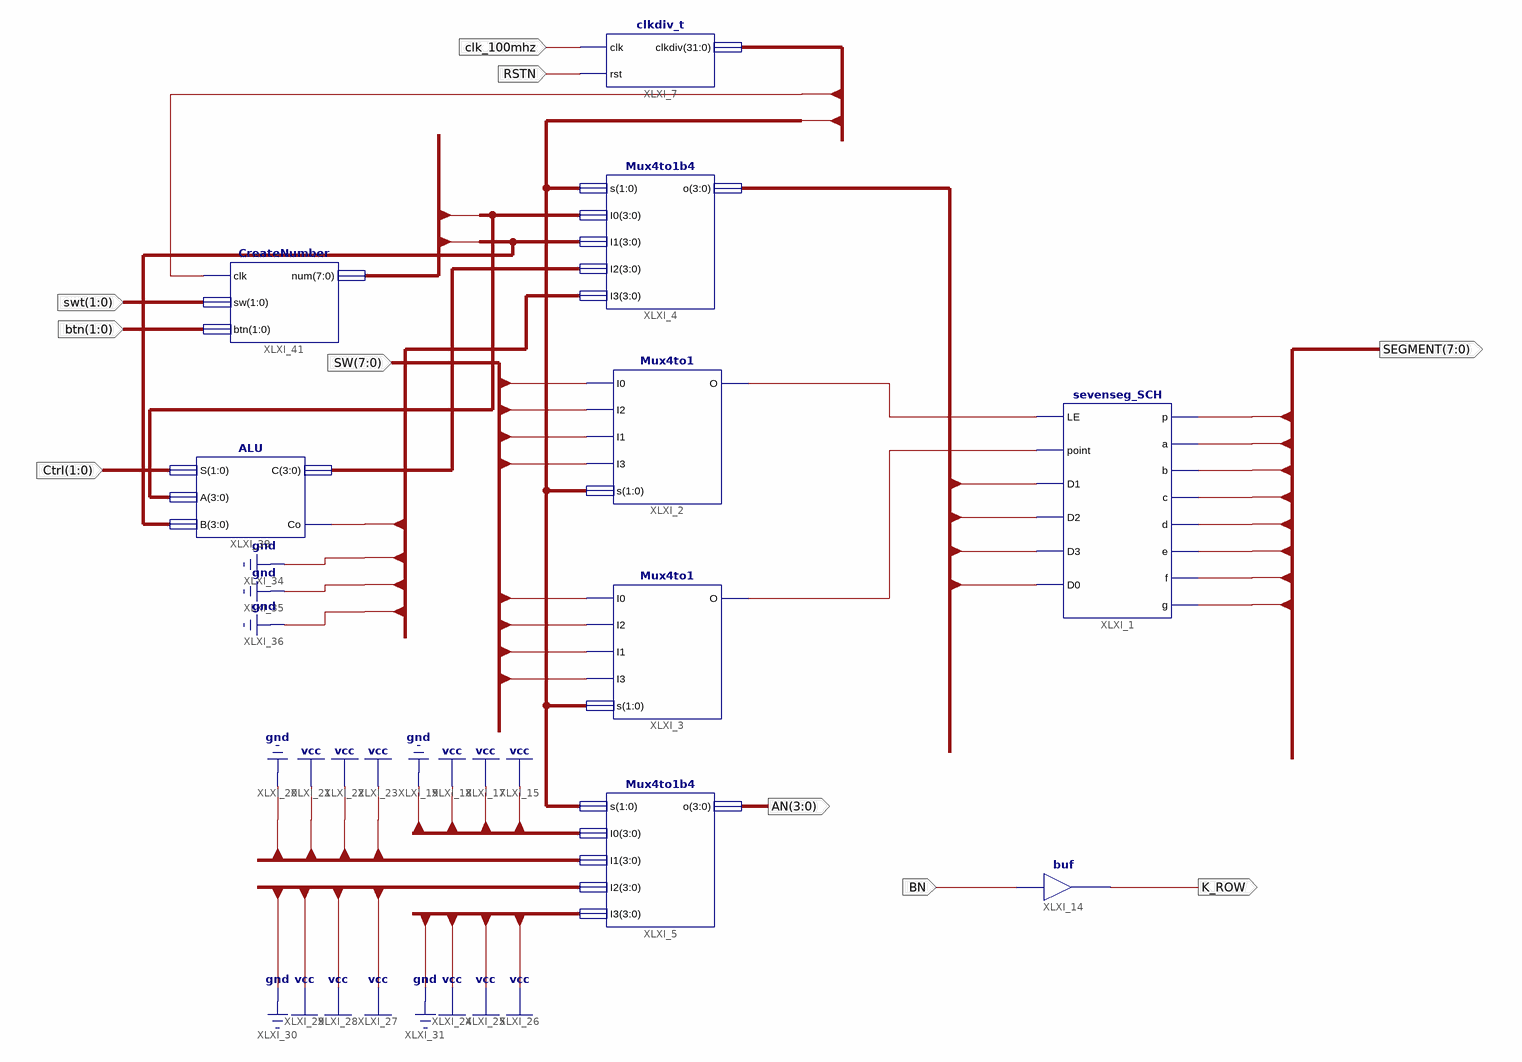
[diagram p0: schematic sheet 1]
// Xilinx ISE schematic scoreboard_sch.sch (kintex7) as structural Verilog: 9 symbols, 10 ports
module scoreboard_sch (
  input  [7:0] SW,
  input  BN,
  input  clk_100mhz,
  input  RSTN,
  input  [1:0] Ctrl,
  input  [1:0] swt,
  input  [1:0] btn,
  output [7:0] SEGMENT,
  output K_ROW,
  output [3:0] AN
);

  wire XLXN_23, XLXN_24;
  wire [0:0] I3;
  wire [3:0] o, XLXN_28;
  wire [7:0] num;
  wire [31:0] clkdiv;

  sevenseg_SCH XLXI_1 (
    .LE(XLXN_23), .point(XLXN_24), .D1(o[1]), .D2(o[2]), .D3(o[3]), .D0(o[0]), .p(SEGMENT[7]),
    .a(SEGMENT[0]), .b(SEGMENT[1]), .c(SEGMENT[2]), .d(SEGMENT[3]), .e(SEGMENT[4]), .f(SEGMENT[5]),
    .g(SEGMENT[6]));
  Mux4to1 XLXI_2 (.I0(SW[0]), .I2(SW[2]), .I1(SW[1]), .I3(SW[3]), .s(clkdiv[18:17]), .O(XLXN_23));
  Mux4to1 XLXI_3 (.I0(SW[4]), .I2(SW[6]), .I1(SW[5]), .I3(SW[7]), .s(clkdiv[18:17]), .O(XLXN_24));
  Mux4to1b4 XLXI_4 (.s(clkdiv[18:17]), .I0(num[3:0]), .I1(num[7:4]), .I2(XLXN_28), .I3({3'b000, I3[0]}), .o(o));
  Mux4to1b4 XLXI_5 (.s(clkdiv[18:17]), .I0(4'b1110), .I1(4'b1101), .I2(4'b1011), .I3(4'b0111), .o(AN));
  clkdiv_t XLXI_7 (.clk(clk_100mhz), .rst(RSTN), .clkdiv(clkdiv));
  buf XLXI_14 (K_ROW, BN);
  ALU XLXI_39 (.S(Ctrl), .A(num[3:0]), .B(num[7:4]), .C(XLXN_28), .Co(I3[0]));
  CreateNumber XLXI_41 (.clk(clkdiv[17]), .sw(swt), .btn(btn), .num(num));
endmodule
